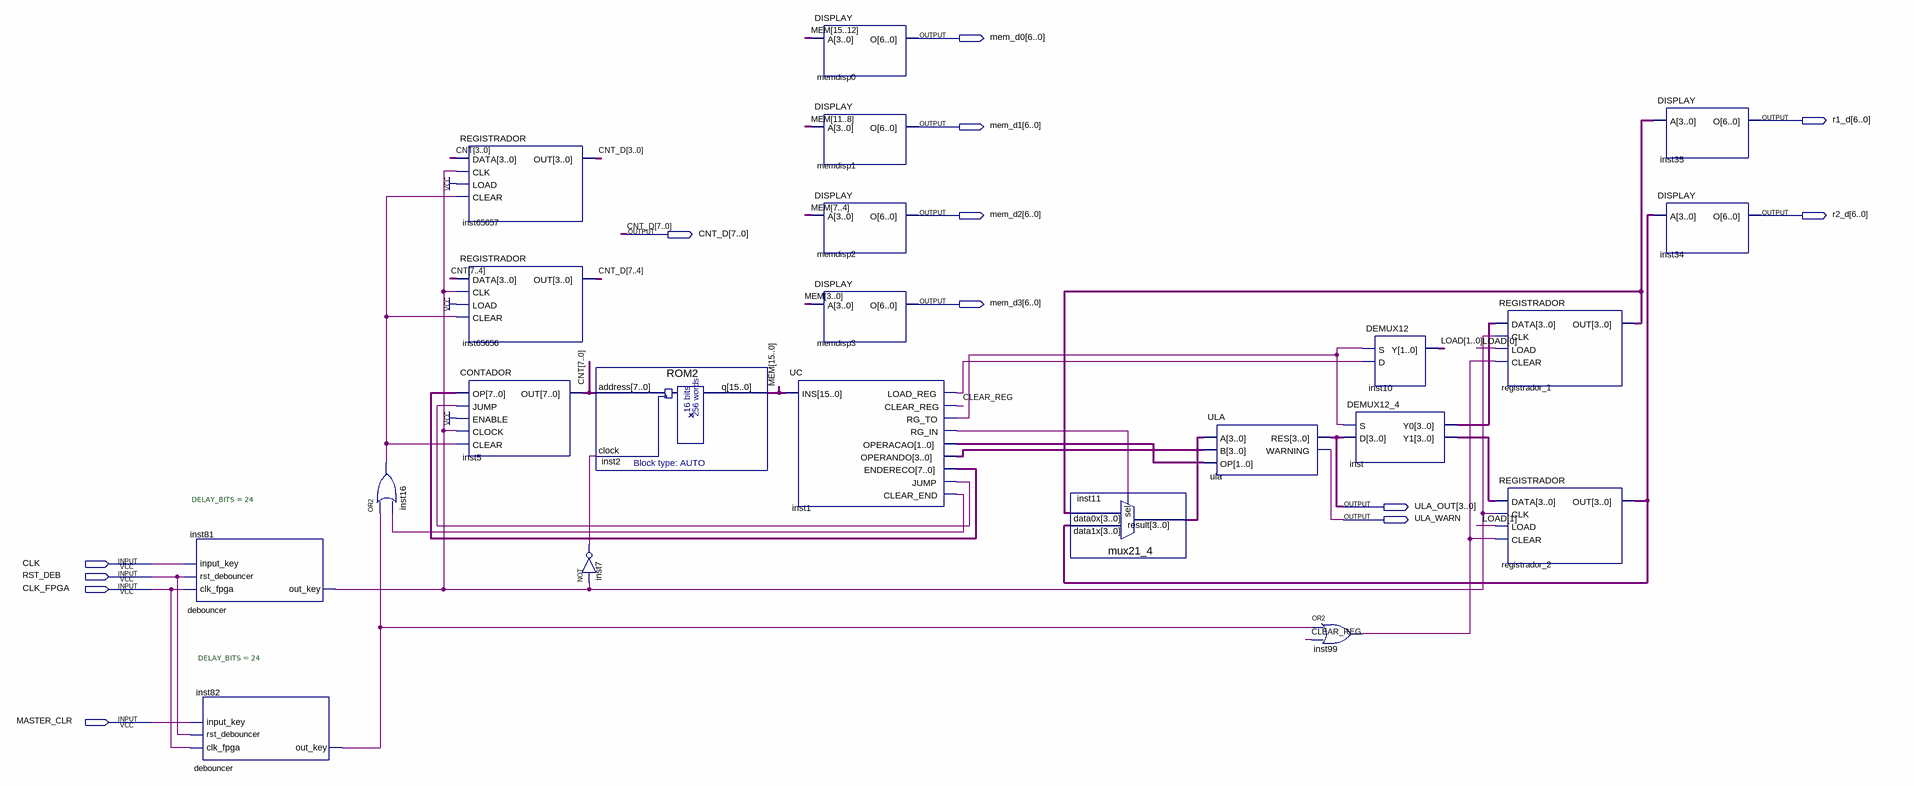
[diagram p0: schematic sheet]
// Quartus schematic TESTE_PRINCIPAL2.bdf as structural Verilog: 22 symbols, 13 pins
module TESTE_PRINCIPAL2 (
  input  CLK,
  input  RST_DEB,
  input  CLK_FPGA,
  input  MASTER_CLR,
  output [6:0] mem_d0,
  output [6:0] r1_d,
  output [6:0] mem_d1,
  output [6:0] mem_d2,
  output [6:0] r2_d,
  output [7:0] CNT_D,
  output [6:0] mem_d3,
  output [3:0] ULA_OUT,
  output ULA_WARN
);

  wire CLEAR_REG, inst1_clear_end, inst1_jump, inst1_load_reg, inst1_rg_in, inst1_rg_to, inst7_out,
       inst16_out, inst81_out_key, inst82_out_key, inst99_out;
  wire [1:0] inst1_operacao, LOAD;
  wire [3:0] inst1_operando, inst11_result, inst_y0, inst_y1, registrador_1_out, registrador_2_out;
  wire [7:0] CNT, inst1_endereco;
  wire [15:0] MEM;

  debouncer #(.DELAY_BITS(24)) inst81 (
    .clk_fpga(CLK_FPGA), .rst_debouncer(RST_DEB), .input_key(CLK), .out_key(inst81_out_key));
  debouncer #(.DELAY_BITS(24)) inst82 (
    .clk_fpga(CLK_FPGA), .rst_debouncer(RST_DEB), .input_key(MASTER_CLR), .out_key(inst82_out_key));
  or inst16 (inst16_out, inst82_out_key, inst1_clear_end);
  REGISTRADOR inst65657 (.DATA(CNT[3:0]), .CLK(inst81_out_key), .LOAD(1'b1), .CLEAR(inst16_out), .OUT(CNT_D[3:0]));
  REGISTRADOR inst65656 (.DATA(CNT[7:4]), .CLK(inst81_out_key), .LOAD(1'b1), .CLEAR(inst16_out), .OUT(CNT_D[7:4]));
  CONTADOR inst5 (
    .OP(inst1_endereco), .JUMP(inst1_jump), .ENABLE(1'b1), .CLOCK(inst81_out_key), .CLEAR(inst16_out),
    .OUT(CNT));
  ROM2 inst2 (.address(CNT), .clock(inst7_out), .q(MEM));
  not inst7 (inst7_out, inst81_out_key);
  UC inst1 (
    .INS(MEM), .LOAD_REG(inst1_load_reg), .CLEAR_REG(CLEAR_REG), .RG_TO(inst1_rg_to), .RG_IN(inst1_rg_in),
    .OPERACAO(inst1_operacao), .OPERANDO(inst1_operando), .ENDERECO(inst1_endereco), .JUMP(inst1_jump),
    .CLEAR_END(inst1_clear_end));
  DISPLAY memdisp0 (.A(MEM[15:12]), .O(mem_d0));
  DISPLAY memdisp1 (.A(MEM[11:8]), .O(mem_d1));
  DISPLAY memdisp2 (.A(MEM[7:4]), .O(mem_d2));
  DISPLAY memdisp3 (.A(MEM[3:0]), .O(mem_d3));
  mux21_4 inst11 (.data1x(registrador_2_out), .data0x(registrador_1_out), .sel(inst1_rg_in), .result(inst11_result));
  ULA ula (.A(inst11_result), .B(inst1_operando), .OP(inst1_operacao), .RES(ULA_OUT), .WARNING(ULA_WARN));
  or inst99 (inst99_out, inst82_out_key, CLEAR_REG);
  DEMUX12 inst10 (.S(inst1_rg_to), .D(inst1_load_reg), .Y(LOAD));
  DEMUX12_4 inst (.S(inst1_rg_to), .D(ULA_OUT), .Y0(inst_y0), .Y1(inst_y1));
  REGISTRADOR registrador_1 (
    .DATA(inst_y0), .CLK(inst81_out_key), .LOAD(LOAD[0]), .CLEAR(inst99_out), .OUT(registrador_1_out));
  REGISTRADOR registrador_2 (
    .DATA(inst_y1), .CLK(inst81_out_key), .LOAD(LOAD[1]), .CLEAR(inst99_out), .OUT(registrador_2_out));
  DISPLAY inst35 (.A(registrador_1_out), .O(r1_d));
  DISPLAY inst34 (.A(registrador_2_out), .O(r2_d));
endmodule
